# Altium schematic sheet analog.SCHDOC
size B
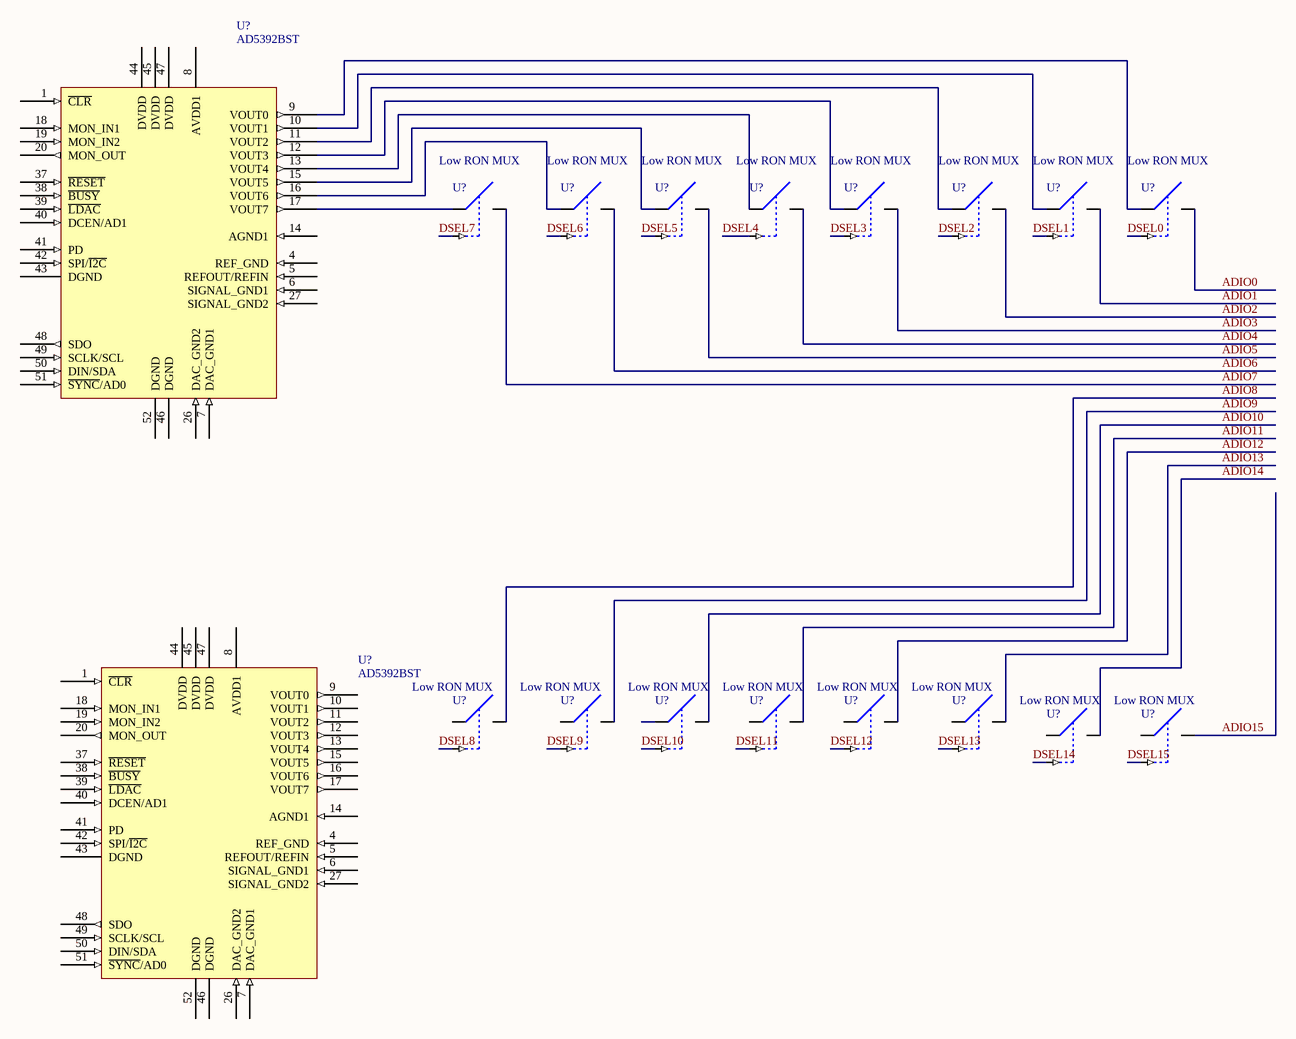
[diagram p0: analog.SCHDOC]

## Parts
(Parts that share a designator on the sheet are numbered #1, #2 ... from top to bottom, then left to right.)
U?#1  Low RON MUX  [AD RM-8]
U?#2  Low RON MUX  [AD RM-8]
U?#3  Low RON MUX  [AD RM-8]
U?#4  Low RON MUX  [AD RM-8]
U?#5  Low RON MUX  [AD RM-8]
U?#6  Low RON MUX  [AD RM-8]
U?#7  Low RON MUX  [AD RM-8]
U?#8  Low RON MUX  [AD RM-8]
U?#9  AD5392BST  [QFP10x10-G52/Y1.6N]
U?#10  Low RON MUX  [AD RM-8]
U?#11  Low RON MUX  [AD RM-8]
U?#12  Low RON MUX  [AD RM-8]
U?#13  Low RON MUX  [AD RM-8]
U?#14  Low RON MUX  [AD RM-8]
U?#15  Low RON MUX  [AD RM-8]
U?#16  Low RON MUX  [AD RM-8]
U?#17  Low RON MUX  [AD RM-8]
U?#18  AD5392BST  [QFP10x10-G52/Y1.6N]

## Nets
GND: U?#1.7(GND) U?#2.7(GND) U?#3.7(GND) U?#4.7(GND) U?#5.7(GND) U?#6.7(GND) U?#7.7(GND) U?#8.7(GND) U?#10.7(GND) U?#11.7(GND) U?#12.7(GND) U?#13.7(GND) U?#14.7(GND) U?#15.7(GND) U?#16.7(GND) U?#17.7(GND)
VDD: U?#1.4(VDD) U?#2.4(VDD) U?#3.4(VDD) U?#4.4(VDD) U?#5.4(VDD) U?#6.4(VDD) U?#7.4(VDD) U?#8.4(VDD) U?#10.4(VDD) U?#11.4(VDD) U?#12.4(VDD) U?#13.4(VDD) U?#14.4(VDD) U?#15.4(VDD) U?#16.4(VDD) U?#17.4(VDD)
ADIO0: U?#8.8(S)
ADIO1: U?#7.8(S)
ADIO2: U?#6.8(S)
ADIO3: U?#5.8(S)
ADIO4: U?#4.8(S)
ADIO5: U?#3.8(S)
ADIO6: U?#2.8(S)
ADIO7: U?#1.8(S)
ADIO8: U?#10.8(S)
ADIO9: U?#11.8(S)
ADIO10: U?#12.8(S)
ADIO11: U?#13.8(S)
ADIO12: U?#14.8(S)
ADIO13: U?#15.8(S)
ADIO14: U?#16.8(S)
ADIO15: U?#17.8(S)
DSEL0: U?#8.6(IN)
DSEL1: U?#7.6(IN)
DSEL2: U?#6.6(IN)
DSEL3: U?#5.6(IN)
DSEL4: U?#4.6(IN)
DSEL5: U?#3.6(IN)
DSEL6: U?#2.6(IN)
DSEL7: U?#1.6(IN)
DSEL8: U?#10.6(IN)
DSEL9: U?#11.6(IN)
DSEL10: U?#12.6(IN)
DSEL11: U?#13.6(IN)
DSEL12: U?#14.6(IN)
DSEL13: U?#15.6(IN)
DSEL14: U?#16.6(IN)
DSEL15: U?#17.6(IN)
NetU?#1_1: U?#1.1(D) U?#9.17(VOUT7)
NetU?#2_1: U?#2.1(D) U?#9.16(VOUT6)
NetU?#3_1: U?#3.1(D) U?#9.15(VOUT5)
NetU?#4_1: U?#4.1(D) U?#9.13(VOUT4)
NetU?#5_1: U?#5.1(D) U?#9.12(VOUT3)
NetU?#6_1: U?#6.1(D) U?#9.11(VOUT2)
NetU?#7_1: U?#7.1(D) U?#9.10(VOUT1)
NetU?#8_1: U?#8.1(D) U?#9.9(VOUT0)

Not connected (* = marked no-connect by the designer): U?#9 1(~{CLR}) 4(REF_GND) 5(REFOUT/REFIN) 6(SIGNAL_GND1) 7(DAC_GND1) 8(AVDD1) 14(AGND1) 18(MON_IN1) 19(MON_IN2) 20(MON_OUT) 26(DAC_GND2) 27(SIGNAL_GND2) 37(~{RESET}) 38(~{BUSY}) 39(~{LDAC}) 40(DCEN/AD1) 41(PD) 42(SPI/~{I2C}) 43(DGND) 44(DVDD) 45(DVDD) 46(DGND) 47(DVDD) 48(SDO) 49(SCLK/SCL) 50(DIN/SDA) 51(~{SYNC}/AD0) 52(DGND); U?#10 1(D); U?#11 1(D); U?#12 1(D); U?#13 1(D); U?#14 1(D); U?#15 1(D); U?#16 1(D); U?#17 1(D); U?#18 1(~{CLR}) 4(REF_GND) 5(REFOUT/REFIN) 6(SIGNAL_GND1) 7(DAC_GND1) 8(AVDD1) 9(VOUT0) 10(VOUT1) 11(VOUT2) 12(VOUT3) 13(VOUT4) 14(AGND1) 15(VOUT5) 16(VOUT6) 17(VOUT7) 18(MON_IN1) 19(MON_IN2) 20(MON_OUT) 26(DAC_GND2) 27(SIGNAL_GND2) 37(~{RESET}) 38(~{BUSY}) 39(~{LDAC}) 40(DCEN/AD1) 41(PD) 42(SPI/~{I2C}) 43(DGND) 44(DVDD) 45(DVDD) 46(DGND) 47(DVDD) 48(SDO) 49(SCLK/SCL) 50(DIN/SDA) 51(~{SYNC}/AD0) 52(DGND)

## Library data of the parts
U?#1-U?#8 U?#10-U?#17 = ADG802: Low Ron single-supply SPST NO mux.
U?#9 U?#18 = AD5392BST: 8-chan 14-BIT DAC